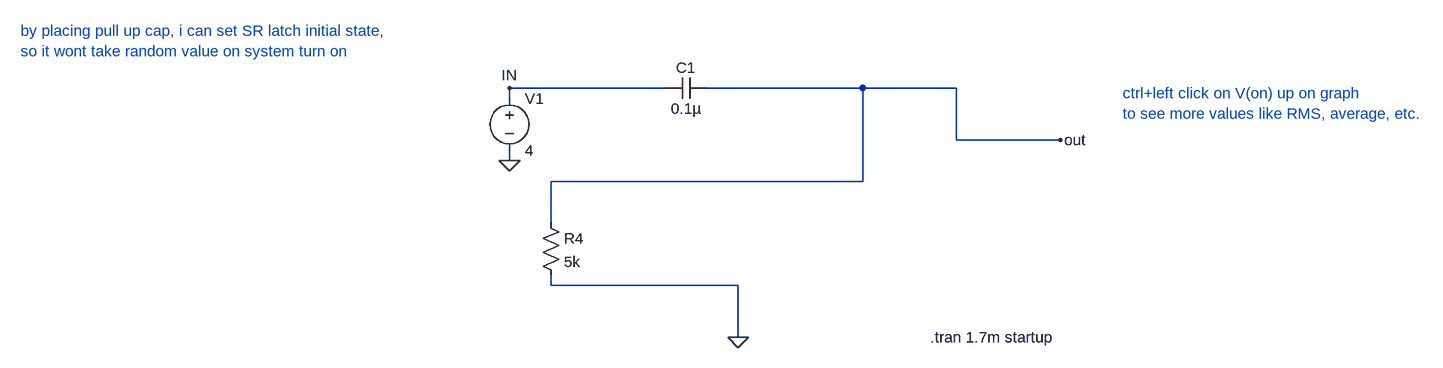
[diagram p0: schematic cap_initial_charge.asc]
cap_initial_charge.asc, the LTspice schematic file:
Version 4.1
SHEET 1 2828 1764
WIRE 1632 1264 1392 1264
WIRE 1936 1264 1696 1264
WIRE 2080 1264 1936 1264
WIRE 1392 1280 1392 1264
WIRE 2080 1344 2080 1264
WIRE 2240 1344 2080 1344
WIRE 1392 1376 1392 1360
WIRE 1936 1408 1936 1264
WIRE 1936 1408 1456 1408
WIRE 1456 1472 1456 1408
WIRE 1456 1568 1456 1552
WIRE 1744 1568 1456 1568
WIRE 1744 1648 1744 1568
FLAG 1744 1648 0
FLAG 1392 1376 0
FLAG 1392 1264 IN
FLAG 2240 1344 out
SYMBOL VOLTAGE 1392 1264 R0
SYMATTR InstName V1
SYMATTR Value 4
SYMBOL res 1440 1456 R0
SYMATTR InstName R4
SYMATTR Value 5k
SYMBOL cap 1696 1248 R90
WINDOW 0 0 32 VBottom 2
WINDOW 3 32 32 VTop 2
SYMATTR InstName C1
SYMATTR Value 0.1µ
TEXT 2040 1648 Left 2 !.tran 1.7m startup
TEXT 2336 1272 Left 2 ;ctrl+left click on V(on) up on graph\nto see more values like RMS, average, etc.
TEXT 640 1176 Left 2 ;by placing pull up cap, i can set SR latch initial state,\nso it wont take random value on system turn on

The netlist it stands for:
* cap_initial_charge.asc
V1 IN 0 4
R4 out 0 5k
C1 out IN 0.1µ
.tran 1.7m startup
* ctrl+left click on V(on) up on graph
* to see more values like RMS, average, etc.
* by placing pull up cap, i can set SR latch initial state,
* so it wont take random value on system turn on
.backanno
.end

* Results of the author's LTspice run, read from the files saved beside the schematic
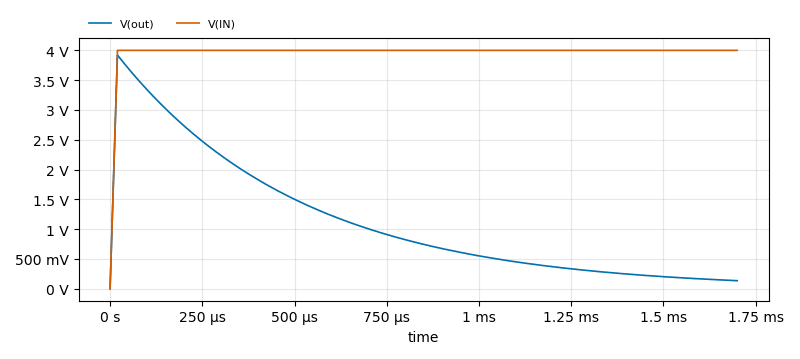
[diagram p1: Transient Analysis of cap_initial_charge.asc, plotted from the saved traces]
* Transient Analysis, 1 run:
*   V(out): min 0 V, max 3.921 V, average 1.136 V, rms 1.523 V, last 136.2 mV
*   V(IN): min 0 V, max 4 V, average 3.976 V, rms 3.984 V, last 4 V